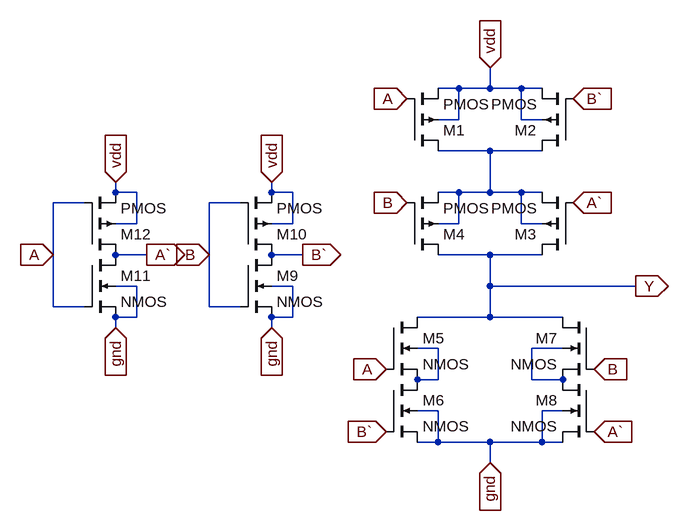
[diagram p0: schematic xnor.asc]
xnor.asc, the LTspice schematic file:
Version 4
SHEET 1 880 680
WIRE 80 -176 48 -176
WIRE 128 -176 128 -208
WIRE 128 -176 80 -176
WIRE 176 -176 128 -176
WIRE 208 -176 176 -176
WIRE 80 -128 80 -176
WIRE 80 -128 48 -128
WIRE 176 -128 176 -176
WIRE 208 -128 176 -128
WIRE 128 -80 48 -80
WIRE 208 -80 128 -80
WIRE -448 -16 -448 -32
WIRE -416 -16 -448 -16
WIRE -208 -16 -208 -32
WIRE -176 -16 -208 -16
WIRE 80 -16 48 -16
WIRE 128 -16 128 -80
WIRE 128 -16 80 -16
WIRE 176 -16 128 -16
WIRE 208 -16 176 -16
WIRE -496 0 -544 0
WIRE -256 0 -304 0
WIRE -416 32 -416 -16
WIRE -416 32 -448 32
WIRE -176 32 -176 -16
WIRE -176 32 -208 32
WIRE 80 32 80 -16
WIRE 80 32 48 32
WIRE 176 32 176 -16
WIRE 208 32 176 32
WIRE -544 80 -544 0
WIRE -400 80 -448 80
WIRE -304 80 -304 0
WIRE -160 80 -208 80
WIRE 128 80 48 80
WIRE 208 80 128 80
WIRE -416 128 -448 128
WIRE -176 128 -208 128
WIRE 128 128 128 80
WIRE 352 128 128 128
WIRE -544 160 -544 80
WIRE -496 160 -544 160
WIRE -304 160 -304 80
WIRE -256 160 -304 160
WIRE -416 176 -416 128
WIRE -416 176 -448 176
WIRE -176 176 -176 128
WIRE -176 176 -208 176
WIRE 128 176 128 128
WIRE 128 176 16 176
WIRE 240 176 128 176
WIRE -448 192 -448 176
WIRE -208 192 -208 176
WIRE 48 224 16 224
WIRE 240 224 192 224
WIRE 48 272 48 224
WIRE 48 272 16 272
WIRE 192 272 192 224
WIRE 240 272 192 272
WIRE 48 320 16 320
WIRE 240 320 208 320
WIRE 48 368 48 320
WIRE 48 368 16 368
WIRE 128 368 48 368
WIRE 208 368 208 320
WIRE 208 368 128 368
WIRE 240 368 208 368
WIRE 128 400 128 368
FLAG 128 -208 vdd
IOPIN 128 -208 In
FLAG 0 -160 A
IOPIN 0 -160 In
FLAG -32 256 A
IOPIN -32 256 In
FLAG 0 0 B
IOPIN 0 0 In
FLAG 288 256 B
IOPIN 288 256 In
FLAG 256 -160 B`
IOPIN 256 -160 In
FLAG -32 352 B`
IOPIN -32 352 In
FLAG 256 0 A`
IOPIN 256 0 In
FLAG 288 352 A`
IOPIN 288 352 In
FLAG 352 128 Y
IOPIN 352 128 Out
FLAG -544 80 A
IOPIN -544 80 In
FLAG -304 80 B
IOPIN -304 80 In
FLAG -400 80 A`
IOPIN -400 80 Out
FLAG -160 80 B`
IOPIN -160 80 Out
FLAG -208 -32 vdd
IOPIN -208 -32 In
FLAG -448 -32 vdd
IOPIN -448 -32 In
FLAG -208 192 gnd
IOPIN -208 192 In
FLAG -448 192 gnd
IOPIN -448 192 In
FLAG 128 400 gnd
IOPIN 128 400 In
SYMBOL pmos4 0 -80 M180
SYMATTR InstName M1
SYMBOL pmos4 256 -80 R180
SYMATTR InstName M2
SYMBOL pmos4 256 80 R180
SYMATTR InstName M3
SYMBOL pmos4 0 80 M180
SYMATTR InstName M4
SYMBOL nmos4 -32 176 R0
SYMATTR InstName M5
SYMBOL nmos4 -32 272 R0
SYMATTR InstName M6
SYMBOL nmos4 288 176 M0
SYMATTR InstName M7
SYMBOL nmos4 288 272 M0
SYMATTR InstName M8
SYMBOL nmos4 -256 80 R0
SYMATTR InstName M9
SYMBOL pmos4 -256 80 M180
SYMATTR InstName M10
SYMBOL nmos4 -496 80 R0
SYMATTR InstName M11
SYMBOL pmos4 -496 80 M180
SYMATTR InstName M12

The netlist it stands for:
* xnor.asc
M1 N001 A vdd vdd PMOS
M2 N001 B` vdd vdd PMOS
M3 Y A` N001 N001 PMOS
M4 Y B N001 N001 PMOS
M5 Y A N002 N002 NMOS
M6 N002 B` gnd gnd NMOS
M7 Y B N003 N003 NMOS
M8 N003 A` gnd gnd NMOS
M9 B` B gnd gnd NMOS
M10 B` B vdd vdd PMOS
M11 A` A gnd gnd NMOS
M12 A` A vdd vdd PMOS
.model NMOS NMOS
.model PMOS PMOS
.lib standard.mos
.backanno
.end